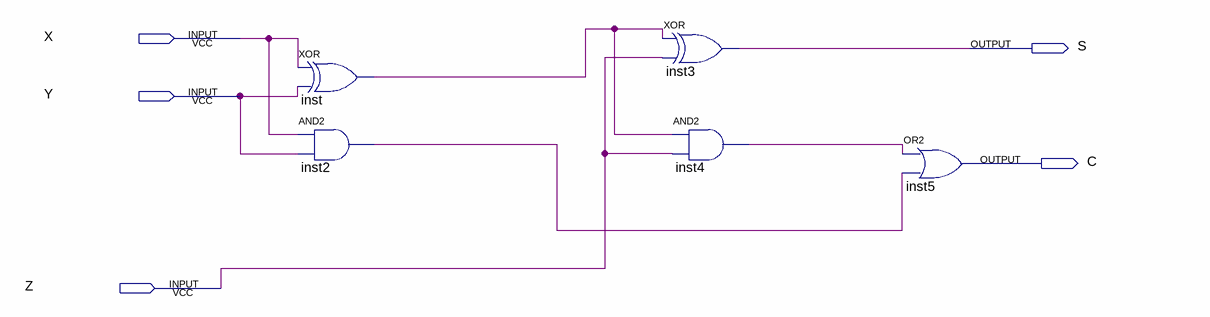
[diagram p0: schematic sheet]
// Quartus schematic fulladder.bdf as structural Verilog: 5 symbols, 5 pins
module fulladder (
  input  X,
  input  Y,
  input  Z,
  output S,
  output C
);

  wire inst2_out, inst4_out, inst_out;

  xor inst (inst_out, X, Y);
  and inst2 (inst2_out, X, Y);
  xor inst3 (S, inst_out, Z);
  and inst4 (inst4_out, inst_out, Z);
  or inst5 (C, inst4_out, inst2_out);
endmodule
